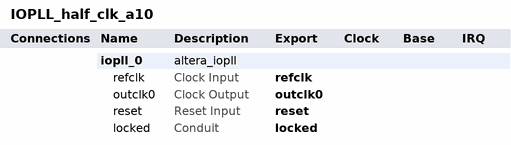
[diagram p0: system contents]
# Platform Designer (Qsys) system IOPLL_half_clk_a10, Arria 10 10AX115S3F45I2SGE2
# Parameters at their usual value, and those the tool derives, are not listed.
package require -exact qsys 15.1
create_system IOPLL_half_clk_a10
set_project_property DEVICE_FAMILY {Arria 10}
set_project_property DEVICE 10AX115S3F45I2SGE2

add_instance iopll_0 altera_iopll 15.1
set_instance_property iopll_0 AUTO_EXPORT true
set_instance_parameter_value iopll_0 gui_actual_duty_cycle0 50.0
set_instance_parameter_value iopll_0 gui_actual_output_clock_frequency0 100.0
set_instance_parameter_value iopll_0 gui_actual_phase_shift0 0.0
set_instance_parameter_value iopll_0 gui_actual_phase_shift_deg0 0.0
set_instance_parameter_value iopll_0 gui_clock_name_global0 false
set_instance_parameter_value iopll_0 gui_device_speed_grade 1
set_instance_parameter_value iopll_0 gui_en_lvds_ports false
set_instance_parameter_value iopll_0 gui_mif_generate false
set_instance_parameter_value iopll_0 gui_number_of_clocks 1
set_instance_parameter_value iopll_0 gui_operation_mode direct
set_instance_parameter_value iopll_0 gui_output_clock_frequency0 161.1328125
set_instance_parameter_value iopll_0 gui_reference_clock_frequency 322.265625
set_instance_parameter_value iopll_0 gui_use_locked true
set_instance_parameter_value iopll_0 gui_vco_frequency 600.0
set_instance_parameter_value iopll_0 system_info_device_component 10AX115S3F45I2SGE2
set_instance_parameter_value iopll_0 system_info_device_speed_grade 2
set_instance_parameter_value iopll_0 system_part_trait_speed_grade 2
set_instance_parameter_value iopll_0 use_NDFB_modes false

# exported interfaces
add_interface locked conduit end
set_interface_property locked EXPORT_OF iopll_0.locked
add_interface outclk0 clock source
set_interface_property outclk0 EXPORT_OF iopll_0.outclk0
add_interface refclk clock sink
set_interface_property refclk EXPORT_OF iopll_0.refclk
add_interface reset reset sink
set_interface_property reset EXPORT_OF iopll_0.reset

set_interconnect_requirement {$system} qsys_mm.clockCrossingAdapter HANDSHAKE
set_interconnect_requirement {$system} qsys_mm.enableEccProtection FALSE
set_interconnect_requirement {$system} qsys_mm.insertDefaultSlave FALSE
set_interconnect_requirement {$system} qsys_mm.maxAdditionalLatency 1

save_system IOPLL_half_clk_a10.qsys
